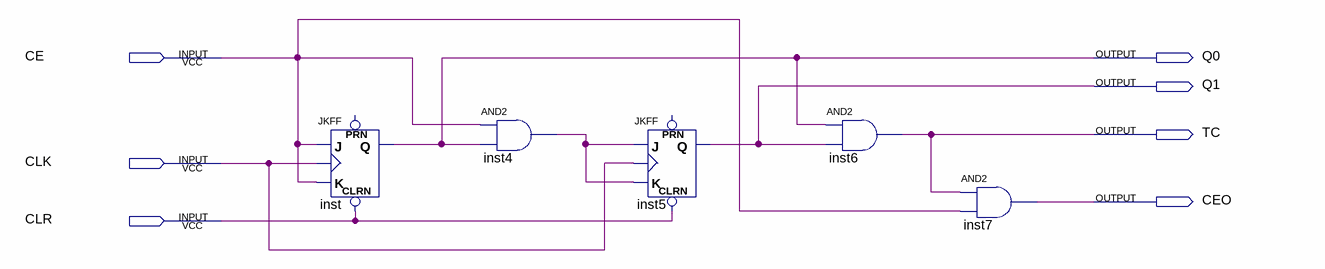
[diagram p0: schematic sheet]
// Quartus schematic contador.bdf as structural Verilog: 5 symbols, 7 pins
module contador (
  input  CE,
  input  CLK,
  input  CLR,
  output Q0,
  output Q1,
  output TC,
  output CEO
);

  wire inst4_out;

  JKFF inst (.CLRN(CLR), .K(CE), .J(CE), .CLK(CLK), .Q(Q0));  // open: PRN
  and inst4 (inst4_out, CE, Q0);
  JKFF inst5 (.CLRN(CLR), .K(inst4_out), .J(inst4_out), .CLK(CLK), .Q(Q1));  // open: PRN
  and inst6 (TC, Q0, Q1);
  and inst7 (CEO, TC, CE);
endmodule
